# Altium schematic sheet Shield.SchDoc
size A4
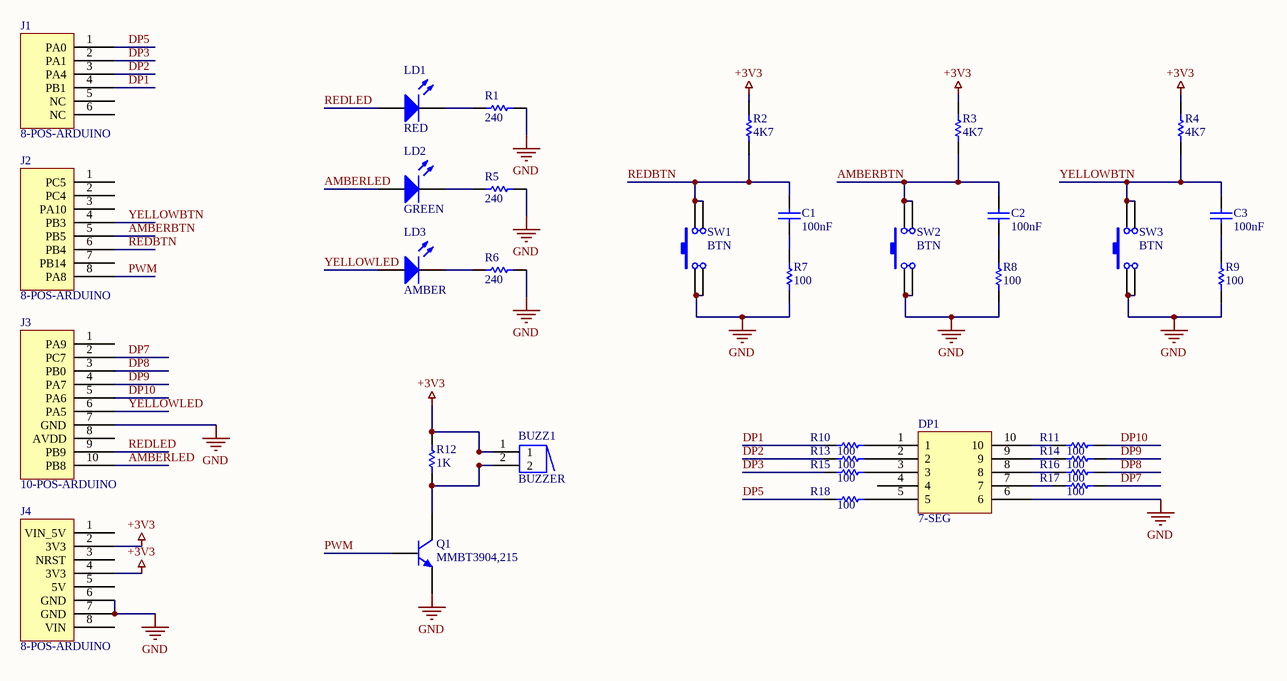
[diagram p0: Shield.SchDoc]

## Parts
BUZZ1  BUZZER  [Buzzer]
C1  100nF  [CAPC3216X12N]
C2  100nF  [CAPC3216X12N]
C3  100nF  [CAPC3216X12N]
DP1  7-SEG  [7-seg-display]
J1  8-POS-ARDUINO  [PIN 6]
J2  8-POS-ARDUINO  [PIN 8]
J3  10-POS-ARDUINO  [PIN 10]
J4  8-POS-ARDUINO  [PIN 8]
LD1  RED  [DIOC3216X21N]
LD2  GREEN  [DIOC3216X21N]
LD3  AMBER  [DIOC3216X21N]
Q1  MMBT3904,215  [SOT95P230X110-3N]
R1  240  [RESC3115X06N]
R2  4K7  [RESC3115X06N]
R3  4K7  [RESC3115X06N]
R4  4K7  [RESC3115X06N]
R5  240  [RESC3115X06N]
R6  240  [RESC3115X06N]
R7  100  [RESC3115X06N]
R8  100  [RESC3115X06N]
R9  100  [RESC3115X06N]
R10  100  [RESC3115X06N]
R11  100  [RESC3115X06N]
R12  1K  [RESC3115X06N]
R13  100  [RESC3115X06N]
R14  100  [RESC3115X06N]
R15  100  [RESC3115X06N]
R16  100  [RESC3115X06N]
R17  100  [RESC3115X06N]
R18  100  [RESC3115X06N]
SW1  BTN  [Button]
SW2  BTN  [Button]
SW3  BTN  [Button]

## Nets
+3V3: BUZZ1.1 J4.2(3V3) J4.4(3V3) R2.2 R3.2 R4.2 R12.2
GND: DP1.6 J3.7(GND) J4.6(GND) J4.7(GND) Q1.2(E) R1.2 R5.2 R6.2 R7.1 R8.1 R9.1 SW1.1 SW1.2 SW2.1 SW2.2 SW3.1 SW3.2
AMBERBTN: C2.2 J2.5(PB5) R3.1 SW2.3 SW2.4
AMBERLED: J3.10(PB8) LD2.1(A)
DP1: J1.4(PB1) R10.2
DP2: J1.3(PA4) R13.2
DP3: J1.2(PA1) R15.2
DP5: J1.1(PA0) R18.2
DP7: J3.2(PC7) R17.1
DP8: J3.3(PB0) R16.1
DP9: J3.4(PA7) R14.1
DP10: J3.5(PA6) R11.1
PWM: J2.8(PA8) Q1.1(B)
REDBTN: C1.2 J2.6(PB4) R2.1 SW1.3 SW1.4
REDLED: J3.9(PB9) LD1.1(A)
YELLOWBTN: C3.2 J2.4(PB3) R4.1 SW3.3 SW3.4
YELLOWLED: J3.6(PA5) LD3.1(A)
NetBUZZ1_2: BUZZ1.2 Q1.3(C) R12.1
NetC1_1: C1.1 R7.2
NetC2_1: C2.1 R8.2
NetC3_1: C3.1 R9.2
NetDP1_1: DP1.1 R10.1
NetDP1_2: DP1.2 R13.1
NetDP1_3: DP1.3 R15.1
NetDP1_5: DP1.5 R18.1
NetDP1_7: DP1.7 R17.2
NetDP1_8: DP1.8 R16.2
NetDP1_9: DP1.9 R14.2
NetDP1_10: DP1.10 R11.2
NetLD1_2: LD1.2(K) R1.1
NetLD2_2: LD2.2(K) R5.1
NetLD3_2: LD3.2(K) R6.1

Not connected (* = marked no-connect by the designer): DP1 4; J1 5(NC) 6(NC); J2 1(PC5) 2(PC4) 3(PA10) 7(PB14); J3 1(PA9) 8(AVDD); J4 1(VIN_5V) 3(NRST) 5(5V) 8(VIN)

## Library data of the parts
BUZZ1 = PS1240P02BT: AUDIO PIEZO TRANSDUCER 30V TH; Manufacturer: TDK; Frequency: 4kHz; Operating Supply Voltage: 3V; Washable: No; Supplier 1: Digi-Key; Manufacturer Part Number: PS1240P02BT; Stock 1: 21154; Pricing 1: 1 = 0,68000, 10 = 0,57800, 25 = 0,54040, 50 = 0,51240, 100 = 0,48530 (USD); RoHS: Yes; Mount: Through Hole; Number of Terminals: 2; Min Operating Temperature: -10°C; Max Operating Temperature: 70°C; Package Quantity: 1; Packaging: Tape and Reel; Termination: PC Pins; Voltage Rating (DC): 3V; Diameter: 12.2mm; Height: 6.5mm; Lead Free: Lead Free; ComponentLink1URL: https://datasheet.ciiva.com/0/ef532-ps-112.pdf?src-supplier=Digi-Key; ComponentLink1Description: https://datasheet.ciiva.com/0/ef532-ps-112.pdf?src-supplier=Digi-Key; ComponentLink2URL: https://datasheet.ciiva.com/16225/ef532-ps-16225062.pdf?src-supplier=Onlinecomponents.com; ComponentLink2Description: https://datasheet.ciiva.com/16225/ef532-ps-16225062.pdf?src-supplier=Onlinecomponents.com; ComponentLink3URL: https://datasheet.ciiva.com/3306/ef532-ps-3306958.pdf?src-supplier=Avnet; ComponentLink3Description: https://datasheet.ciiva.com/3306/ef532-ps-3306958.pdf?src-supplier=Avnet; ComponentLink4URL: https://datasheet.ciiva.com/0/ef532-ps-111.pdf?src-supplier=Digi-Key; ComponentLink4Description: https://datasheet.ciiva.com/0/ef532-ps-111.pdf?src-supplier=Digi-Key; Supplier Part Number 1: 445-2525-1-ND
C1-C3 = CC1206KRX7R9BB104: CAP CER 0.1UF 50V X7R 1206; Manufacturer: Yageo; Material: Ceramic; Tolerance: 10%; Insulation Resistance: 100GR; Supplier 1: Digi-Key; Manufacturer Part Number: CC1206KRX7R9BB104; Stock 1: 5890110; Pricing 1: 1 = 0,19000, 10 = 0,13000, 100 = 0,06610, 500 = 0,04520, 1000 = 0,03999 (USD); RoHS: Yes; Mount: Surface Mount; Case/Package: 1206; Number of Pins: 2; Case Code (Metric): 3216; Case Code (Imperial): 1206; Min Operating Temperature: -55°C; Max Operating Temperature: 125°C; Packaging: Tape and Reel; Capacitance: 100nF; Voltage Rating: 50V; Package Quantity: 1; Dielectric: X7R; Termination: SMD/SMT; Voltage: 50V; Voltage Rating (DC): 50V; Length: 3.2mm; Height: 0.85mm; Width: 0.063inch; Thickness: 0.033inch; Depth: 1.6mm; Radiation Hardening: No; REACH SVHC: Unknown; Lead Free: Lead Free; Halogen Free: Halogen Free; ComponentLink1URL: https://datasheet.ciiva.com/11786/0900766b80d84f1d-11786968.pdf?src-supplier=RSComponents; ComponentLink1Description: https://datasheet.ciiva.com/11786/0900766b80d84f1d-11786968.pdf?src-supplier=RSComponents; ComponentLink2URL: https://datasheet.ciiva.com/7978/1489800-7978230.pdf?src-supplier=Element14; ComponentLink2Description: https://datasheet.ciiva.com/7978/1489800-7978230.pdf?src-supplier=Element14; ComponentLink3URL: https://datasheet.ciiva.com/16625/upy-gphc-x7r-6-3v-to-50v-8-16625558.pdf?src-supplier=Avnet+Europe; ComponentLink3Description: https://datasheet.ciiva.com/16625/upy-gphc-x7r-6-3v-to-50v-8-16625558.pdf?src-supplier=Avnet+Europe; ComponentLink4URL: https://datasheet.ciiva.com/46385/1734573-46385063.pdf?src-supplier=Element14; ComponentLink4Description: https://datasheet.ciiva.com/46385/1734573-46385063.pdf?src-supplier=Element14; ComponentLink5URL: https://datasheet.ciiva.com/28363/1734573-28363672.pdf?src-supplier=Element14; ComponentLink5Description: https://datasheet.ciiva.com/28363/1734573-28363672.pdf?src-supplier=Element14; ComponentLink6URL: https://datasheet.ciiva.com/144/mlccorderingcode-144905.pdf?src-supplier=Digi-Key; ComponentLink6Description: https://datasheet.ciiva.com/144/mlccorderingcode-144905.pdf?src-supplier=Digi-Key; ComponentLink7URL: https://datasheet.ciiva.com/5425/upy-gp-np0-16v-to-50v-8-3714-5425561.pdf?src-supplier=Mouser; ComponentLink7Description: https://datasheet.ciiva.com/5425/upy-gp-np0-16v-to-50v-8-3714-5425561.pdf?src-supplier=Mouser; ComponentLink8URL: https://datasheet.ciiva.com/144/mlccorderingcode-144906.pdf?src-supplier=Digi-Key; ComponentLink8Description: https://datasheet.ciiva.com/144/mlccorderingcode-144906.pdf?src-supplier=Digi-Key; ComponentLink9URL: https://datasheet.ciiva.com/144/mlccorderingcode-144907.pdf?src-supplier=Digi-Key; ComponentLink9Description: https://datasheet.ciiva.com/144/mlccorderingcode-144907.pdf?src-supplier=Digi-Key; ComponentLink10URL: https://datasheet.ciiva.com/15189/getdatasheetpartid-251811-15189275.pdf?src-supplier=Verical; ComponentLink10Description: https://datasheet.ciiva.com/15189/getdatasheetpartid-251811-15189275.pdf?src-supplier=Verical; ComponentLink11URL: https://datasheet.ciiva.com/28450/1489800-28450892.pdf?src-supplier=Element14; ComponentLink11Description: https://datasheet.ciiva.com/28450/1489800-28450892.pdf?src-supplier=Element14; Supplier Part Number 1: 311-1179-1-ND
DP1 = INND-TS40YGCB: Manufacturer: Inolux; Supplier 1: Digi-Key; Manufacturer Part Number: INND-TS40YGCB; Stock 1: 5781; Pricing 1: 1 = 1,10000, 10 = 0,89500, 100 = 0,55080, 500 = 0,46818, 1000 = 0,38556, 2500 = 0,36628, 5000 = 0,35802, 10000 = 0,34976, 25000 = 0,34425 (USD); RoHS: No; Supplier Part Number 1: 1830-1154-ND
J1 = PREC006SABN-RC: Conn Header Vert 6POS 2.54MM; Manufacturer: Sullins; Number of Positions: 6; Connector Type: Male Pin; Pitch: 0.1inch; Supplier 1: Digi-Key; Manufacturer Part Number: PREC006SABN-RC; Stock 1: 1610; Pricing 1: 1 = 0,16000, 10 = 0,15100, 25 = 0,12920, 50 = 0,11280, 100 = 0,10480, 250 = 0,09272, 500 = 0,08870 (USD); RoHS: Yes; Mount: Through Hole; Color: Black; Contact Plating: Tin; Package Quantity: 1; Number of Rows: 1; Packaging: Bulk; Termination: Solder; Contact Mating Length: 0.23inch; ComponentLink1URL: https://datasheet.ciiva.com/741/xrxczzzsxxn-rc-st-11635-b-741039.pdf?src-supplier=Digi-Key; ComponentLink1Description: https://datasheet.ciiva.com/741/xrxczzzsxxn-rc-st-11635-b-741039.pdf?src-supplier=Digi-Key; Supplier Part Number 1: S1022EC-06-ND
J2 = PREC008SAAN-RC: CONN HEADER VERT 8POS 2.54MM; Manufacturer: Sullins; Number of Positions: 8; Connector Type: Male Pin; Pitch: 0.1inch; Supplier 1: Digi-Key; Manufacturer Part Number: PREC008SAAN-RC; Stock 1: 3323; Pricing 1: 1 = 0,19000, 10 = 0,17800, 25 = 0,15200, 50 = 0,13300, 100 = 0,12360, 250 = 0,10928, 500 = 0,10454 (USD); RoHS: Yes; Mount: Through Hole; Color: Black; Contact Plating: Tin; Package Quantity: 1; Number of Rows: 1; Packaging: Bulk; Termination: Solder; Contact Mating Length: 0.23inch; ComponentLink1URL: https://datasheet.ciiva.com/740/zrzczzzszzn-rc-st-11635-b-740837.pdf?src-supplier=Digi-Key; ComponentLink1Description: https://datasheet.ciiva.com/740/zrzczzzszzn-rc-st-11635-b-740837.pdf?src-supplier=Digi-Key; Supplier Part Number 1: S1012EC-08-ND
J3 = PREC010SAAN-RC: CONN HEADER .100" SNGL STR 10POS; Manufacturer: Sullins; Number of Positions: 10; Connector Type: Male Pin; Pitch: 0.1inch; Supplier 1: Digi-Key; Manufacturer Part Number: PREC010SAAN-RC; Stock 1: 2330; Pricing 1: 1 = 0,24000, 10 = 0,22300, 25 = 0,19000, 50 = 0,16640, 100 = 0,15440, 250 = 0,13664, 500 = 0,13068 (USD); RoHS: Yes; Mount: Through Hole; Color: Black; Contact Plating: Tin; Package Quantity: 1; Number of Rows: 1; Packaging: Bulk; Termination: Solder; Contact Mating Length: 0.23inch; ComponentLink1URL: https://datasheet.ciiva.com/740/zrzczzzszzn-rc-st-11635-b-740835.pdf?src-supplier=Digi-Key; ComponentLink1Description: https://datasheet.ciiva.com/740/zrzczzzszzn-rc-st-11635-b-740835.pdf?src-supplier=Digi-Key; Supplier Part Number 1: S1012EC-10-ND
J4 = PREC008SAAN-RC (2): CONN HEADER VERT 8POS 2.54MM; Manufacturer: Sullins; Number of Positions: 8; Connector Type: Male Pin; Pitch: 0.1inch; Supplier 1: Digi-Key; Manufacturer Part Number: PREC008SAAN-RC; Stock 1: 3323; Pricing 1: 1 = 0,19000, 10 = 0,17800, 25 = 0,15200, 50 = 0,13300, 100 = 0,12360, 250 = 0,10928, 500 = 0,10454 (USD); RoHS: Yes; Mount: Through Hole; Color: Black; Contact Plating: Tin; Package Quantity: 1; Number of Rows: 1; Packaging: Bulk; Termination: Solder; Contact Mating Length: 0.23inch; ComponentLink1URL: https://datasheet.ciiva.com/740/zrzczzzszzn-rc-st-11635-b-740837.pdf?src-supplier=Digi-Key; ComponentLink1Description: https://datasheet.ciiva.com/740/zrzczzzszzn-rc-st-11635-b-740837.pdf?src-supplier=Digi-Key; Supplier Part Number 1: S1012EC-08-ND
LD1 = LTST-C150CKT: LED Uni-Color Red 660nm 2-Pin Chip LED T/R; Manufacturer: Vishay Lite-On; Lens Color: Colorless; Max Power Dissipation: 100mW; Lens Style: Diffused; Viewing Angle: 130°; Forward Current: 40mA; Forward Voltage: 1.8V; Luminous Intensity: 25mcd; Dominant Wavelength: 638nm; Test Current: 10mA; Lens Transparency: Clear; Number of Elements: 1; Reverse Voltage: 5V; Supplier 1: Digi-Key; Manufacturer Part Number: LTST-C150CKT; Stock 1: 244566; Pricing 1: 1 = 0,35000, 10 = 0,25700, 100 = 0,12190, 500 = 0,08128, 1000 = 0,06366 (USD); RoHS: Yes; Mount: Surface Mount; Case/Package: 1206; Number of Pins: 2; Color: Red; Case Code (Metric): 3216; Case Code (Imperial): 1206; Min Operating Temperature: -55°C; Max Operating Temperature: 85°C; Packaging: Tape and Reel; Package Quantity: 1; Illumination Color: Red; Power Rating: 100mW; Power Dissipation: 100mW; Wavelength: 660nm; Number of LEDs: 1; Length: 3.2mm; Height: 1.1mm; Width: 1.6mm; Depth: 1.6mm; Radiation Hardening: No; Lead Free: Lead Free; ComponentLink1URL: https://datasheet.ciiva.com/2110/ltst-c150ckt-2110225.pdf?src-supplier=Digi-Key; ComponentLink1Description: https://datasheet.ciiva.com/2110/ltst-c150ckt-2110225.pdf?src-supplier=Digi-Key; ComponentLink2URL: https://datasheet.ciiva.com/16222/lite-on20ltst-c150ckt-16222610.pdf?src-supplier=Future+Electronics; ComponentLink2Description: https://datasheet.ciiva.com/16222/lite-on20ltst-c150ckt-16222610.pdf?src-supplier=Future+Electronics; ComponentLink3URL: https://datasheet.ciiva.com/11775/0900766b80dc025c-11775635.pdf?src-supplier=RSComponents; ComponentLink3Description: https://datasheet.ciiva.com/11775/0900766b80dc025c-11775635.pdf?src-supplier=RSComponents; ComponentLink4URL: https://datasheet.ciiva.com/15117/getdatasheetpartid-103928-15117444.pdf?src-supplier=Verical; ComponentLink4Description: https://datasheet.ciiva.com/15117/getdatasheetpartid-103928-15117444.pdf?src-supplier=Verical; ComponentLink5URL: https://datasheet.ciiva.com/19465/697733-19465844.pdf?src-supplier=Jameco; ComponentLink5Description: https://datasheet.ciiva.com/19465/697733-19465844.pdf?src-supplier=Jameco; ComponentLink6URL: https://datasheet.ciiva.com/2110/s-110-ltst-c150ckt-2110226.pdf?src-supplier=Digi-Key; ComponentLink6Description: https://datasheet.ciiva.com/2110/s-110-ltst-c150ckt-2110226.pdf?src-supplier=Digi-Key; ComponentLink7URL: https://datasheet.ciiva.com/2110/s-110-ltst-c150ckt-2110227.pdf?src-supplier=Digi-Key; ComponentLink7Description: https://datasheet.ciiva.com/2110/s-110-ltst-c150ckt-2110227.pdf?src-supplier=Digi-Key; Supplier Part Number 1: 160-1167-1-ND
LD2 = LTST-C150GKT: LED GREEN CLEAR 1206 SMD; Manufacturer: Vishay Lite-On; Lens Color: Colorless; Lens Style: Diffused; Number of LEDs: 1; Luminous Intensity: 6mcd; Forward Voltage: 2.1V; Test Current: 10mA; Wavelength: 565nm; Reverse Voltage: 5V; Forward Current: 30mA; Viewing Angle: 130°; Power Rating: 100mW; Dominant Wavelength: 569nm; Supplier 1: Digi-Key; Manufacturer Part Number: LTST-C150GKT; Stock 1: 429365; Pricing 1: 1 = 0,33000, 10 = 0,24000, 100 = 0,11390, 500 = 0,07594, 1000 = 0,05948 (USD); RoHS: Yes; Mount: Surface Mount; Case/Package: 1206; Number of Pins: 2; Color: Green; Case Code (Metric): 3216; Case Code (Imperial): 1206; Min Operating Temperature: -55°C; Max Operating Temperature: 85°C; Packaging: Tape and Reel; Package Quantity: 1; Illumination Color: Green; Lens Transparency: Clear; Number of Elements: 1; Power Dissipation: 100mW; Max Power Dissipation: 100mW; Length: 3.2mm; Height: 1.1mm; Width: 1.6mm; Depth: 1.6mm; Radiation Hardening: No; Lead Free: Lead Free; ComponentLink1URL: https://datasheet.ciiva.com/2110/ltst-c150gkt-2110032.pdf?src-supplier=Digi-Key; ComponentLink1Description: https://datasheet.ciiva.com/2110/ltst-c150gkt-2110032.pdf?src-supplier=Digi-Key; ComponentLink2URL: https://datasheet.ciiva.com/12400/lite-on-ltst-c150gkt-187412-12400912.pdf?src-supplier=Mouser; ComponentLink2Description: https://datasheet.ciiva.com/12400/lite-on-ltst-c150gkt-187412-12400912.pdf?src-supplier=Mouser; ComponentLink3URL: https://datasheet.ciiva.com/11775/0900766b80dc0263-11775637.pdf?src-supplier=RSComponents; ComponentLink3Description: https://datasheet.ciiva.com/11775/0900766b80dc0263-11775637.pdf?src-supplier=RSComponents; ComponentLink4URL: https://datasheet.ciiva.com/4266/s-110-ltst-c150gkt-4266310.pdf?src-supplier=Arrow; ComponentLink4Description: https://datasheet.ciiva.com/4266/s-110-ltst-c150gkt-4266310.pdf?src-supplier=Arrow; ComponentLink5URL: https://datasheet.ciiva.com/16375/ltst-c150gkt-16375926.pdf?src-supplier=Future+Electronics; ComponentLink5Description: https://datasheet.ciiva.com/16375/ltst-c150gkt-16375926.pdf?src-supplier=Future+Electronics; ComponentLink6URL: https://datasheet.ciiva.com/15117/getdatasheetpartid-142080-15117739.pdf?src-supplier=Verical; ComponentLink6Description: https://datasheet.ciiva.com/15117/getdatasheetpartid-142080-15117739.pdf?src-supplier=Verical; Supplier Part Number 1: 160-1169-1-ND
LD3 = LTST-C150AKT: LED AMBER CLEAR 1206 SMD; Manufacturer: Vishay Lite-On; Color: Orange; Lens Color: Colorless; Power Rating: 100mW; Luminous Intensity: 6mcd; Viewing Angle: 130°; Forward Voltage: 2.1V; Forward Current: 30mA; Dominant Wavelength: 602nm; Test Current: 10mA; Number of Elements: 1; Wavelength: 610nm; Reverse Voltage: 5V; Supplier 1: Digi-Key; Manufacturer Part Number: LTST-C150AKT; Stock 1: 13106; Pricing 1: 1 = 0,35000, 10 = 0,25700, 100 = 0,12190, 500 = 0,08128, 1000 = 0,06366 (USD); RoHS: Yes; Mount: Surface Mount; Case/Package: 1206; Number of Pins: 2; Case Code (Metric): 3216; Case Code (Imperial): 1206; Min Operating Temperature: -55°C; Max Operating Temperature: 85°C; Packaging: Tape and Reel; Lens Style: Clear; Package Quantity: 1; Illumination Color: Orange; Lens Transparency: Clear; Power Dissipation: 100mW; Number of LEDs: 1; Length: 3.2mm; Height: 1.1mm; Width: 1.6mm; Depth: 1.6mm; Radiation Hardening: No; Lead Free: Lead Free; ComponentLink1URL: https://datasheet.ciiva.com/2110/ltst-c150akt-2110240.pdf?src-supplier=Digi-Key; ComponentLink1Description: https://datasheet.ciiva.com/2110/ltst-c150akt-2110240.pdf?src-supplier=Digi-Key; ComponentLink2URL: https://datasheet.ciiva.com/15117/getdatasheetpartid-147499-15117854.pdf?src-supplier=Verical; ComponentLink2Description: https://datasheet.ciiva.com/15117/getdatasheetpartid-147499-15117854.pdf?src-supplier=Verical; ComponentLink3URL: https://datasheet.ciiva.com/11774/0900766b80dc025b-11774743.pdf?src-supplier=RSComponents; ComponentLink3Description: https://datasheet.ciiva.com/11774/0900766b80dc025b-11774743.pdf?src-supplier=RSComponents; ComponentLink4URL: https://datasheet.ciiva.com/2110/ltst-c150akt-2110241.pdf?src-supplier=Digi-Key; ComponentLink4Description: https://datasheet.ciiva.com/2110/ltst-c150akt-2110241.pdf?src-supplier=Digi-Key; ComponentLink5URL: https://datasheet.ciiva.com/2110/ltst-c150akt-2110242.pdf?src-supplier=Digi-Key; ComponentLink5Description: https://datasheet.ciiva.com/2110/ltst-c150akt-2110242.pdf?src-supplier=Digi-Key; ComponentLink6URL: https://datasheet.ciiva.com/16448/ltst-c150akt-16448581.pdf?src-supplier=Future+Electronics; ComponentLink6Description: https://datasheet.ciiva.com/16448/ltst-c150akt-16448581.pdf?src-supplier=Future+Electronics; Supplier Part Number 1: 160-1166-1-ND
Q1 = MMBT3904,215: TRANS NPN 40V 0.2A SOT23; Manufacturer: Nexperia; Supplier 1: Digi-Key; Manufacturer Part Number: MMBT3904,215; Stock 1: 214014; Pricing 1: 1 = 0,10000, 10 = 0,09500, 100 = 0,05180, 500 = 0,03188, 1000 = 0,02174 (USD); RoHS: No; ComponentLink1URL: http://www.farnell.com/datasheets/2328888.pdf?src-supplier=Farnell; ComponentLink1Description: http://www.farnell.com/datasheets/2328888.pdf?src-supplier=Farnell; ComponentLink2URL: https://assets.nexperia.com/documents/data-sheet/MMBT3904.pdf?src-supplier=Digi-Key; ComponentLink2Description: https://assets.nexperia.com/documents/data-sheet/MMBT3904.pdf?src-supplier=Digi-Key; ComponentLink3URL: http://www.farnell.com/datasheets/2328888.pdf?src-supplier=Newark; ComponentLink3Description: http://www.farnell.com/datasheets/2328888.pdf?src-supplier=Newark; Supplier Part Number 1: 1727-4044-1-ND
R1 R5 R6 = RMCF1206FT240R: Res Thick Film 1206 240 Ohm 1% 0.25W(1/4W) ±100ppm/C Molded SMD Automotive T/R; Manufacturer: Stackpole Electronics; Resistance: 240R; Max Power Dissipation: 250mW; Temperature Coefficient: 100ppm/°C; Supplier 1: Digi-Key; Manufacturer Part Number: RMCF1206FT240R; Stock 1: 2191; Pricing 1: 1 = 0,10000, 10 = 0,03600, 100 = 0,01470, 1000 = 0,00659, 2500 = 0,00572 (USD); RoHS: Yes; Mount: Surface Mount; Case/Package: 1206; Case Code (Metric): 3216; Case Code (Imperial): 1206; Contact Plating: Tin; Min Operating Temperature: -55°C; Max Operating Temperature: 155°C; Packaging: Tape and Reel; Tolerance: 1%; Composition: Thick Film; Number of Terminations: 2; Military Standard: Not; Features: Automotive AEC-Q200; Length: 0.126inch; Height: 0.028inch; Width: 0.063inch; Depth: 1.6mm; Radiation Hardening: No; ComponentLink1URL: http://components.arrow.com/part/dataview/46929293S8409770N1174?src-supplier=Arrow; ComponentLink1Description: http://components.arrow.com/part/dataview/46929293S8409770N1174?src-supplier=Arrow; ComponentLink2URL: https://www.verical.com/server-webapp/html/getDatasheet?partID=465735&src-supplier=Verical; ComponentLink2Description: https://www.verical.com/server-webapp/html/getDatasheet?partID=465735&src-supplier=Verical; ComponentLink3URL: https://www.seielect.com/Catalog/SEI-RMCF_RMCP.pdf?src-supplier=Digi-Key; ComponentLink3Description: https://www.seielect.com/Catalog/SEI-RMCF_RMCP.pdf?src-supplier=Digi-Key; ComponentLink4URL: https://www.seielect.com/catalog/SEI-Packaging.pdf?src-supplier=Digi-Key; ComponentLink4Description: https://www.seielect.com/catalog/SEI-Packaging.pdf?src-supplier=Digi-Key; ComponentLink5URL: https://www.seielect.com/catalog/SEI-RMCF_RMCP.pdf?src-supplier=Avnet; ComponentLink5Description: https://www.seielect.com/catalog/SEI-RMCF_RMCP.pdf?src-supplier=Avnet; Supplier Part Number 1: RMCF1206FT240RCT-ND
R2-R4 = RMCF1206FT4K70: RES SMD 4.7K OHM 1% 1/4W 1206; Manufacturer: Stackpole Electronics; Resistance: 4.7kR; Max Power Dissipation: 250mW; Temperature Coefficient: 100ppm/°C; Supplier 1: Digi-Key; Manufacturer Part Number: RMCF1206FT4K70; Stock 1: 133615; Pricing 1: 1 = 0,10000, 10 = 0,03600, 100 = 0,01470, 1000 = 0,00659, 2500 = 0,00572 (USD); RoHS: Yes; Mount: Surface Mount; Case/Package: 1206; Case Code (Metric): 3216; Case Code (Imperial): 1206; Contact Plating: Tin; Min Operating Temperature: -55°C; Max Operating Temperature: 155°C; Tolerance: 1%; Packaging: Tape and Reel; Composition: Thick Film; Number of Terminations: 2; Military Standard: Not; Features: Automotive AEC-Q200; Length: 0.126inch; Height: 0.028inch; Width: 0.063inch; Depth: 1.6mm; Radiation Hardening: No; ComponentLink1URL: https://www.seielect.com/Catalog/SEI-RMCF_RMCP.pdf?src-supplier=Digi-Key; ComponentLink1Description: https://www.seielect.com/Catalog/SEI-RMCF_RMCP.pdf?src-supplier=Digi-Key; ComponentLink2URL: https://www.verical.com/server-webapp/html/getDatasheet?partID=408276&src-supplier=Verical; ComponentLink2Description: https://www.verical.com/server-webapp/html/getDatasheet?partID=408276&src-supplier=Verical; ComponentLink3URL: http://components.arrow.com/part/dataview/44988237S7495835N1174?src-supplier=Arrow; ComponentLink3Description: http://components.arrow.com/part/dataview/44988237S7495835N1174?src-supplier=Arrow; Supplier Part Number 1: RMCF1206FT4K70CT-ND
R7-R11 R13-R18 = RMCF1206FT100R: RES 100 OHM 1% 1/4W 1206; Manufacturer: Stackpole Electronics; Resistance: 100R; Power Rating: 250mW; Temperature Coefficient: 100ppm/°C; Supplier 1: Digi-Key; Manufacturer Part Number: RMCF1206FT100R; Stock 1: 384311; Pricing 1: 1 = 0,10000, 10 = 0,03600, 100 = 0,01470, 1000 = 0,00659, 2500 = 0,00572 (USD); RoHS: Yes; Mount: Surface Mount; Case/Package: 1206; Case Code (Metric): 3216; Case Code (Imperial): 1206; Contact Plating: Tin; Min Operating Temperature: -55°C; Max Operating Temperature: 155°C; Packaging: Tape and Reel; Tolerance: 1%; Composition: Thick Film; Number of Terminations: 2; Military Standard: Not; Max Power Dissipation: 250mW; Features: Automotive AEC-Q200; Length: 0.126inch; Height: 0.028inch; Width: 0.063inch; Depth: 1.6mm; Radiation Hardening: No; Lead Free: Lead Free; ComponentLink1URL: https://www.seielect.com/catalog/SEI-RMCF_RMCP.pdf?src-supplier=Avnet; ComponentLink1Description: https://www.seielect.com/catalog/SEI-RMCF_RMCP.pdf?src-supplier=Avnet; ComponentLink2URL: http://www.seielect.com/Catalog/SEI-rmc.pdf?src-supplier=Future+Electronics; ComponentLink2Description: http://www.seielect.com/Catalog/SEI-rmc.pdf?src-supplier=Future+Electronics; ComponentLink3URL: https://www.seielect.com/Catalog/SEI-RMCF_RMCP.pdf?src-supplier=Digi-Key; ComponentLink3Description: https://www.seielect.com/Catalog/SEI-RMCF_RMCP.pdf?src-supplier=Digi-Key; ComponentLink4URL: http://components.arrow.com/part/dataview/44988349S7171862N1174?src-supplier=Arrow; ComponentLink4Description: http://components.arrow.com/part/dataview/44988349S7171862N1174?src-supplier=Arrow; ComponentLink5URL: https://www.verical.com/server-webapp/html/getDatasheet?partID=372149&src-supplier=Verical; ComponentLink5Description: https://www.verical.com/server-webapp/html/getDatasheet?partID=372149&src-supplier=Verical; Supplier Part Number 1: RMCF1206FT100RCT-ND
R12 = RNCP1206FTD1K00: RES 1K OHM 1% 1/2W 1206; Manufacturer: Stackpole Electronics; Resistance: 1kR; Max Power Dissipation: 500mW; Temperature Coefficient: 100ppm/°C; Supplier 1: Digi-Key; Manufacturer Part Number: RNCP1206FTD1K00; Stock 1: 424850; Pricing 1: 1 = 0,10000, 10 = 0,09300, 100 = 0,03580, 1000 = 0,01575, 2500 = 0,01360 (USD); RoHS: Yes; Mount: Surface Mount; Case/Package: 1206; Case Code (Metric): 3216; Case Code (Imperial): 1206; Contact Plating: Tin; Min Operating Temperature: -55°C; Max Operating Temperature: 155°C; Tolerance: 1%; Packaging: Tape and Reel; Composition: Thin Film; Number of Terminations: 2; Features: Moisture Resistant; Length: 0.122inch; Height: 0.024inch; Width: 0.059inch; Radiation Hardening: No; Lead Free: Lead Free; ComponentLink1URL: https://www.seielect.com/catalog/SEI-Packaging.pdf?src-supplier=Digi-Key; ComponentLink1Description: https://www.seielect.com/catalog/SEI-Packaging.pdf?src-supplier=Digi-Key; ComponentLink2URL: http://www.seielect.com/Catalog/SEI-rncp.pdf?src-supplier=Avnet; ComponentLink2Description: http://www.seielect.com/Catalog/SEI-rncp.pdf?src-supplier=Avnet; Supplier Part Number 1: RNCP1206FTD1K00CT-ND
SW1-SW3 = PTS647SK70SMTR2LFS: INWALL LENS COVER , WHITE , 6 (; Manufacturer: ITT C&K; Supplier 1: Digi-Key; Manufacturer Part Number: PTS647SK70SMTR2LFS; Stock 1: 97905; Pricing 1: 1 = 0,14000, 10 = 0,14000, 25 = 0,13520, 50 = 0,13020, 100 = 0,12310, 250 = 0,11580, 500 = 0,11100 (USD); RoHS: No; Supplier Part Number 1: PTS647SK70SMTR2LFSCT-ND